# Altium schematic sheet RUMBA_TFT.SchDoc
size A4; PageSetup: Record=PageOptions|CenterHorizontal=True|CenterVertical=True|PrintScale=0.68|XCorrection=1.00|YCorrection=1.00|PrintKind=1|BorderSize=5000000|LeftOffset=0|BottomOffset=0|Orientation=2|PaperLength=1000|PaperWidth=1000|Scale=100|PaperSource=7|PrintQuality=-4|MediaType=1|DitherType=10|PrintScaleMode=1|PaperKind=A3
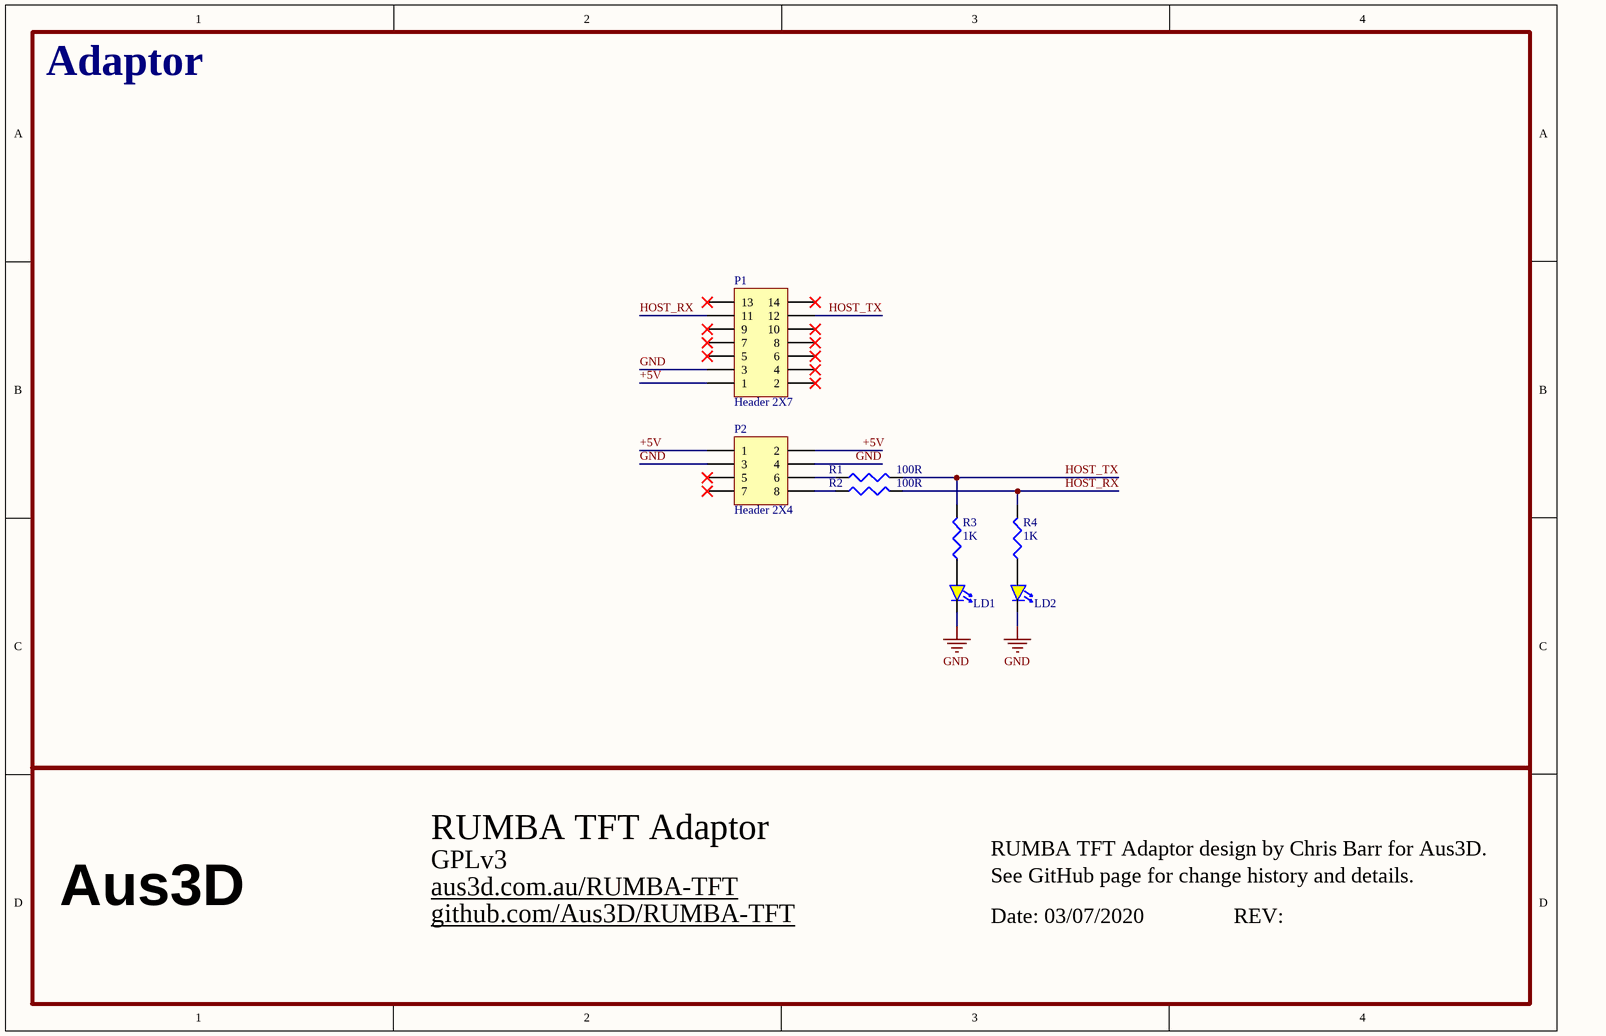
[diagram p0: RUMBA_TFT.SchDoc]

## Parts
LD1  (no value)  [LED 1608-0603]
LD2  (no value)  [LED 1608-0603]
P1  Header 2X7  [HDR2X7-HEADER FEMALE]
P2  Header 2X4  [HDR2X4-HEADER FEMALE - SHROUDED]
R1  value 100R  [RES 1608-0603]  (hidden comment: Resistor)
R2  value 100R  [RES 1608-0603]  (hidden comment: Resistor)
R3  value 1K  [RES 1608-0603]  (hidden comment: Resistor)
R4  value 1K  [RES 1608-0603]  (hidden comment: Resistor)

## Blocks framed on the sheet
Adaptor: LD1 LD2 P1 P2 R1-R4

## Nets
GND: LD1.2(K) LD2.2(K) P1.3 P2.3 P2.4
+5V: P1.1 P2.1 P2.2
HOST_RX: P1.11 R2.2 R4.2
HOST_TX: P1.12 R1.2 R3.2
NetLD1_1: LD1.1(A) R3.1
NetLD2_1: LD2.1(A) R4.1
NetP2_6: P2.6 R1.1
NetP2_8: P2.8 R2.1

Not connected (* = marked no-connect by the designer): P1 2* 4* 5* 6* 7* 8* 9* 10* 13* 14*; P2 5* 7*

## Notes on the sheet
- RUMBA TFT Adaptor
- Aus3D
- github.com/Aus3D/RUMBA-TFT <http://github.com/Aus3D/RUMBA-TFT>
- GPLv3
- aus3d.com.au/RUMBA-TFT <http://aus3d.com.au/RUMBA-TFT>
- RUMBA TFT Adaptor design by Chris Barr for Aus3D.
- Date: 03/07/2020
- See GitHub page for change history and details.
- REV:
- Title
- Size:
- Date:
- File:
- A1
- Number:
- Time:
- Revision:
- Sheet
- of

## Library data of the parts
LD1 LD2 = LEDY  0603: LED YELLOW CLEAR CHIP SMD 0603; Note: Approved sub OK; Supplier 1: Digi-Key; Supplier Part Number 1: 160-1437-1-ND
P1 = Header 2X7 Female: Header, 7-Pin, Dual row, Female; Manufacturer 1: Generic Header; Note: Approved sub OK
P2 = Header 2X4: Header, 4-Pin, Dual row, Shrouded; Manufacturer 1: Molex; Note: Approved sub OK; Supplier 1: Digi-Key; Supplier Part Number 1: 900-0702460801-ND
R1 R2 = RC0603FR-07100RL: RES SMD 100 OHM 1% 1/10W 0603; Manufacturer 1: Yageo; Note: Approved sub OK; Power (Watts): 0.1W, 1/10W; Temperature Coefficient: ±100ppm/°C; Published: 8-Jun-2000; Revision: July-2002: Re-released for DXP Platform.; Publisher: Altium Limited; Supplier 1: Digi-Key; Supplier Part Number 1: 311-100HRCT-ND; Manufacturer Part Number 1: RC0603FR-07100RL; Tolerance: ±1%; Composition: Thick Film; Features: Moisture Resistant; Operating Temperature: -55°C ~ 155°C; Package / Case: 0603 (1608 Metric); Size / Dimension: 0.063" L x 0.031" W (1.60mm x 0.80mm); Height - Seated (Max): 0.022" (0.55mm)
R3 R4 = RC0603FR-071KL: RES SMD 1K OHM 1% 1/10W 0603; Manufacturer 1: Yageo; Note: Approved sub OK; Power (Watts): 0.1W, 1/10W; Temperature Coefficient: ±100ppm/°C; Published: 8-Jun-2000; Revision: July-2002: Re-released for DXP Platform.; Publisher: Altium Limited; Supplier 1: Digi-Key; Supplier Part Number 1: 311-1.00KHRCT-ND; Manufacturer Part Number 1: RC0603FR-071KL; Tolerance: ±1%; Composition: Thick Film; Features: Moisture Resistant; Operating Temperature: -55°C ~ 155°C; Package / Case: 0603 (1608 Metric); Size / Dimension: 0.063" L x 0.031" W (1.60mm x 0.80mm); Height - Seated (Max): 0.022" (0.55mm)